# EasyEDA schematic SCH-Button_LED_EasyEDA.json
TITLE: Sheet_1; REV: 1.0; Date: 2024-01-07; Sheet: 1/1; Drawn By: scottguiness; Company: Your Company
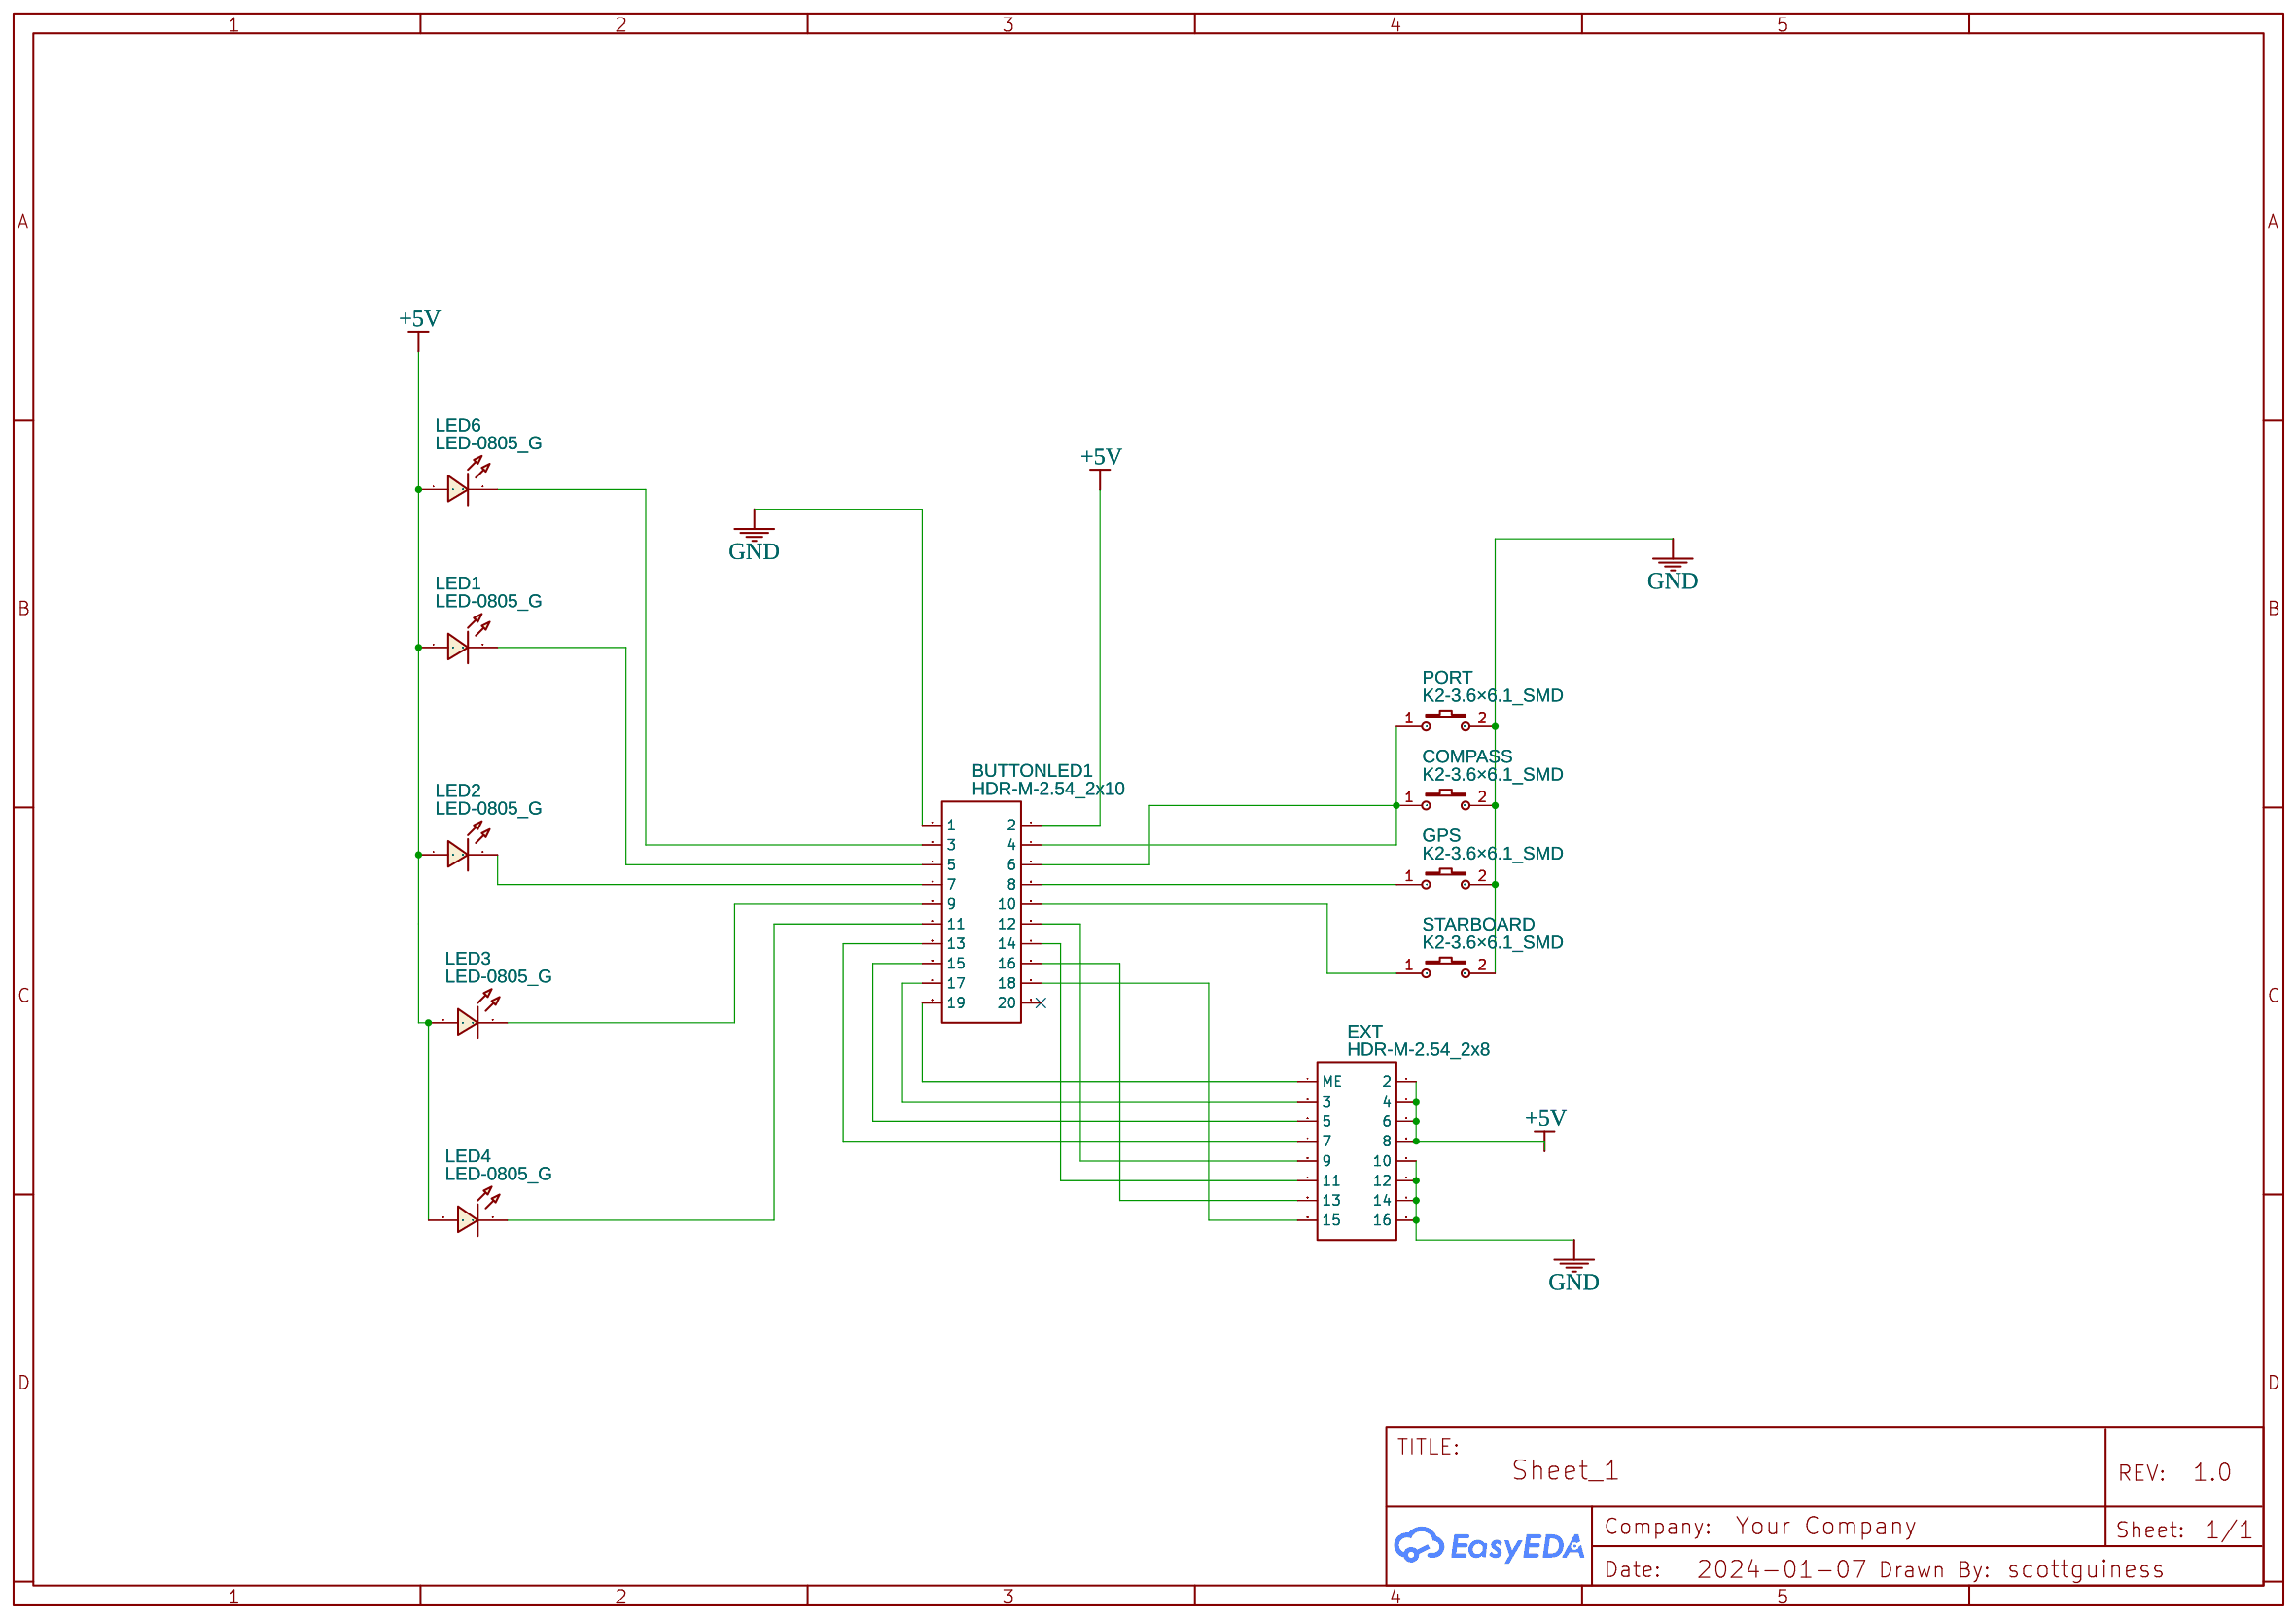
[diagram p0: schematic sheet]

## Parts
BUTTONLED1  HDR-M-2.54_2x10  [HDR-M-2.54_2X10]
COMPASS  K2-3.6×6.1_SMD  [KEY-SMD_2P-L6.2-W3.6-LS8.0]
EXT  HDR-M-2.54_2x8  [HDR-M-2.54_2X8]
GPS  K2-3.6×6.1_SMD  [KEY-SMD_2P-L6.2-W3.6-LS8.0]
LED1  LED-0805_G  [LED0805_GREEN]
LED2  LED-0805_G  [LED0805_GREEN]
LED3  LED-0805_G  [LED0805_GREEN]
LED4  LED-0805_G  [LED0805_GREEN]
LED6  LED-0805_G  [LED0805_GREEN]
PORT  K2-3.6×6.1_SMD  [KEY-SMD_2P-L6.2-W3.6-LS8.0]
STARBOARD  K2-3.6×6.1_SMD  [KEY-SMD_2P-L6.2-W3.6-LS8.0]

## Library data of the parts
BUTTONLED1 = HDR-M-2.54_2x10: Supplier Part: C124359; Supplier: LCSC; Contributor: LCEDA_Lib
COMPASS GPS PORT STARBOARD = K2-3.6×6.1_SMD: Supplier Part: C118141; Supplier: LCSC; Manufacturer Part: K2-1107ST-A4SW-06; Contributor: LCEDA_Lib; 制造商: 韩国韩荣
EXT = HDR-M-2.54_2x8: Supplier Part: C68234; Supplier: LCSC; Contributor: LCEDA_Lib
LED1-LED4 LED6 = LED-0805_G: Manufacturer: 国星光电; Manufacturer Part: NCD0805G1; Supplier Part: C84260; Contributor: LCEDA_Lib

## Nets
+5V: BUTTONLED1.2 EXT.2 EXT.4 EXT.6 EXT.8 LED1.1 LED2.1 LED3.1 LED4.1 LED6.1
GND: BUTTONLED1.1 COMPASS.2 EXT.10 EXT.12 EXT.14 EXT.16 GPS.2 PORT.2 STARBOARD.2
Net-(BUTTONLED1-3): BUTTONLED1.3 LED6.2
Net-(BUTTONLED1-4): BUTTONLED1.4 BUTTONLED1.6 COMPASS.1 PORT.1
Net-(BUTTONLED1-5): BUTTONLED1.5 LED1.2
Net-(BUTTONLED1-7): BUTTONLED1.7 LED2.2
Net-(BUTTONLED1-8): BUTTONLED1.8 GPS.1
Net-(BUTTONLED1-9): BUTTONLED1.9 LED3.2
Net-(BUTTONLED1-10): BUTTONLED1.10 STARBOARD.1
Net-(BUTTONLED1-11): BUTTONLED1.11 LED4.2
Net-(BUTTONLED1-12): BUTTONLED1.12 EXT.9
Net-(BUTTONLED1-13): BUTTONLED1.13 EXT.7
Net-(BUTTONLED1-14): BUTTONLED1.14 EXT.11
Net-(BUTTONLED1-15): BUTTONLED1.15 EXT.5
Net-(BUTTONLED1-16): BUTTONLED1.16 EXT.13
Net-(BUTTONLED1-17): BUTTONLED1.17 EXT.3
Net-(BUTTONLED1-18): BUTTONLED1.18 EXT.15
Net-(BUTTONLED1-19): BUTTONLED1.19 EXT.1(ME)

Not connected (* = marked no-connect by the designer): BUTTONLED1 20*
